# Altium project Convector_digit.PrjPcb
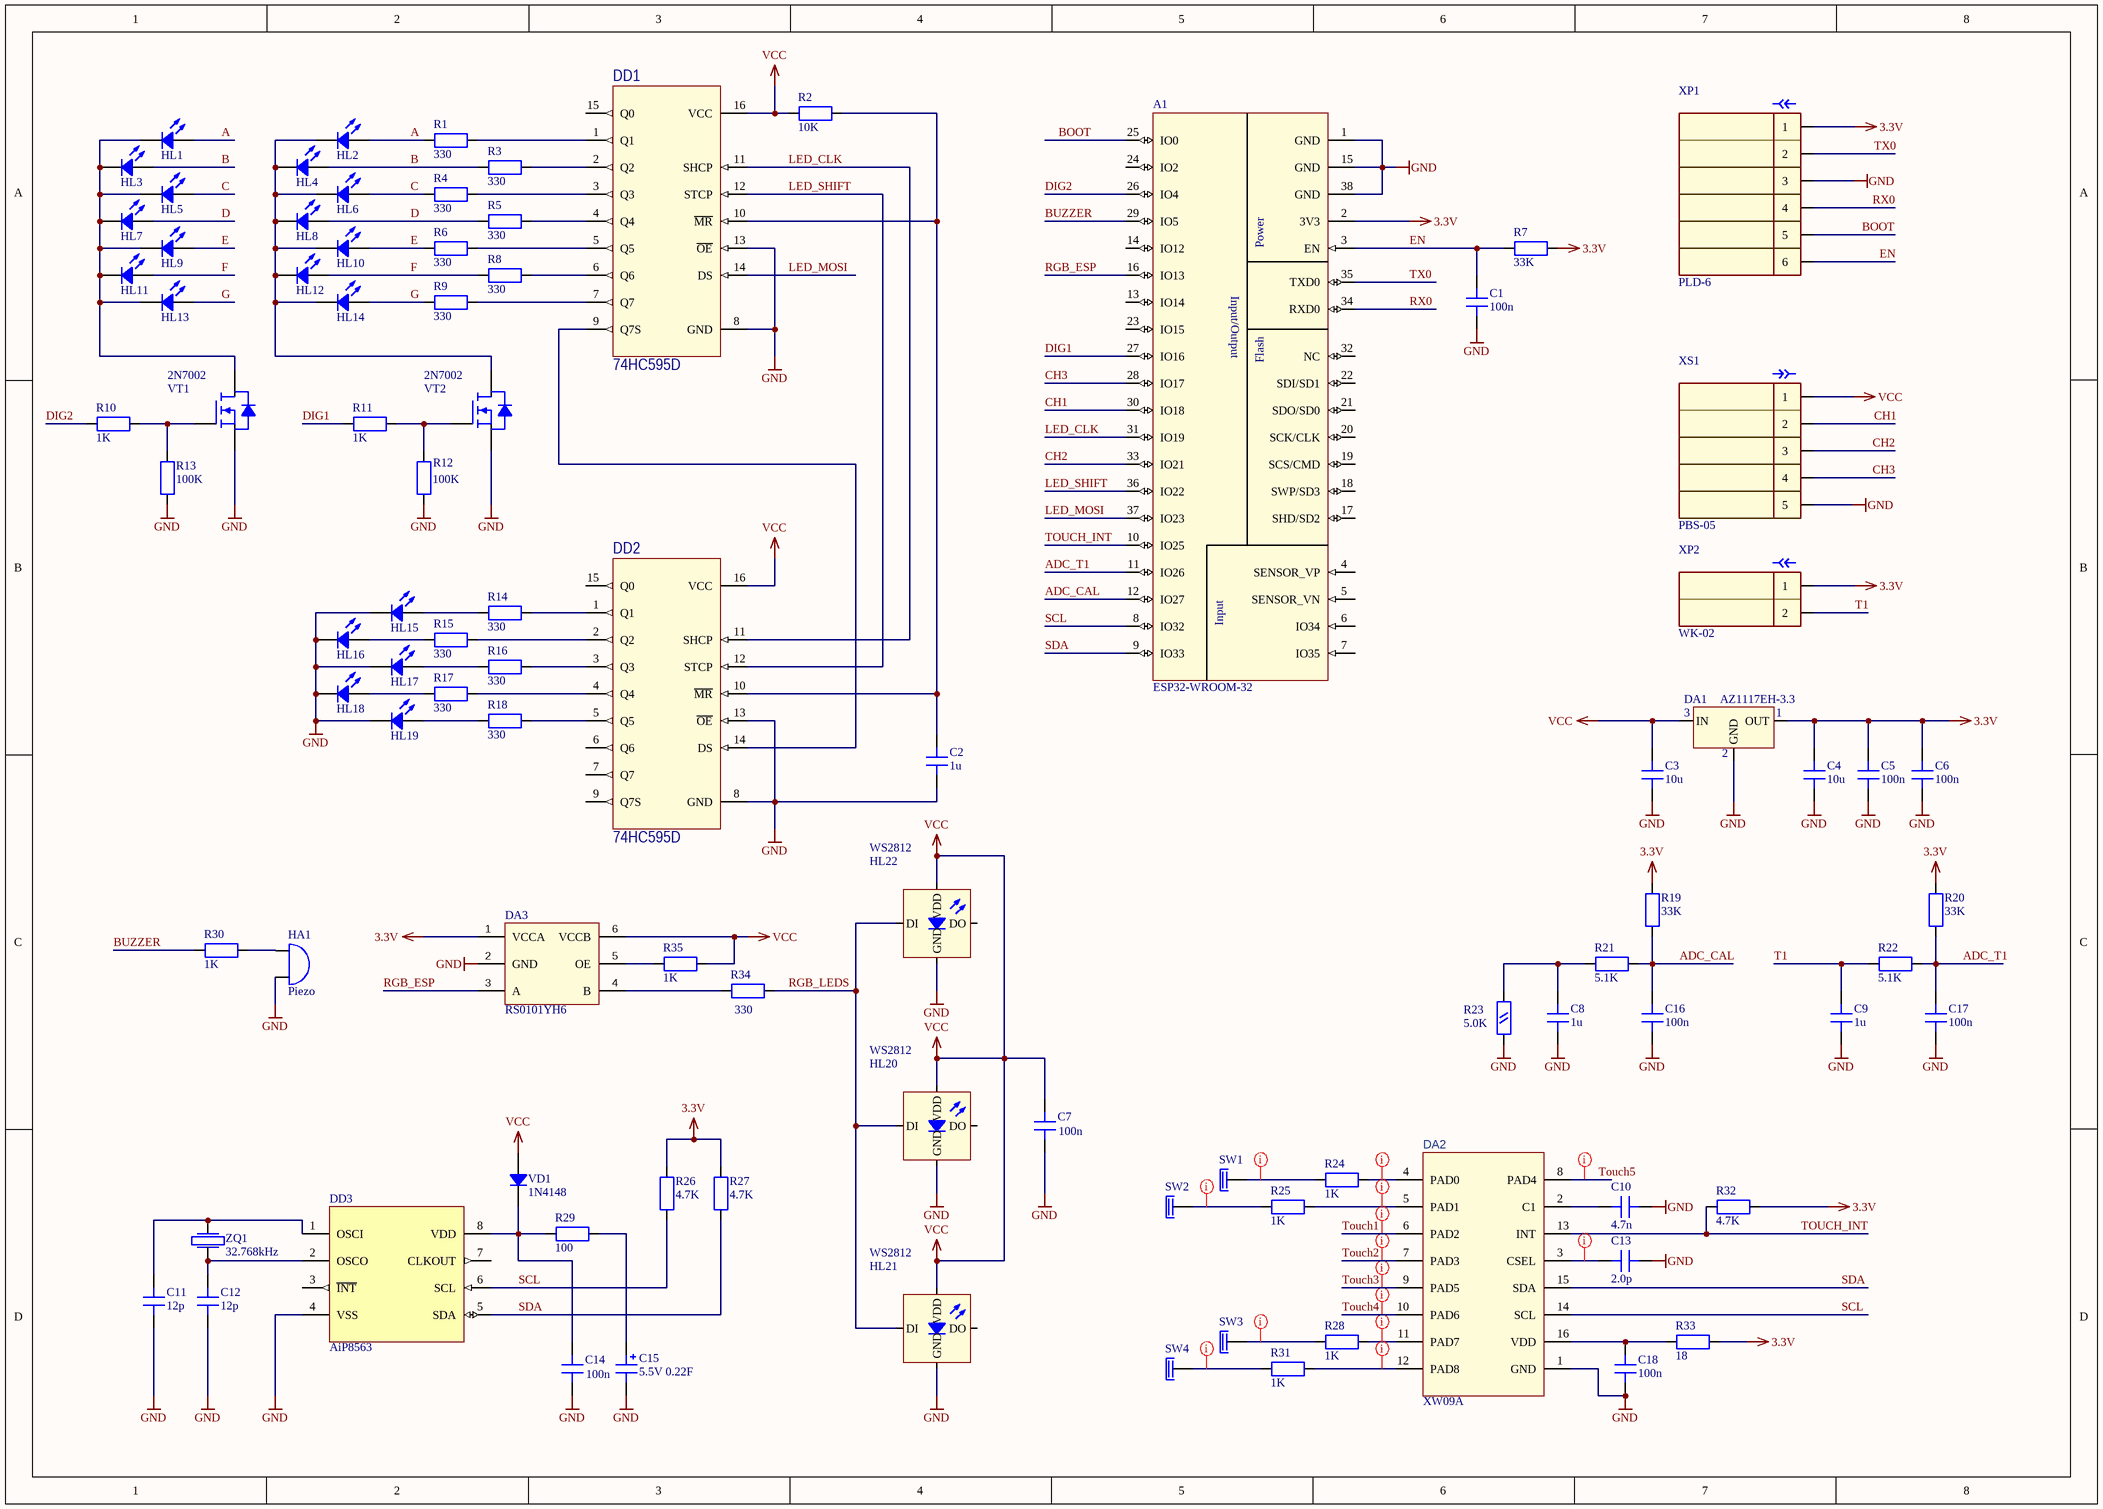
[diagram p0: Convector_digit.SchDoc]
1 sheet, 94 parts. Net scope: global (net labels, ports and power ports of the same name join across sheets).
Board file: Convector_digit.PcbDoc

## Sheet Convector_digit.SchDoc
size A3; SheetNumber: 1; SheetTotal: 1

### Parts
A1  ESP32-WROOM-32  [ESP-WROOM-32]
C1  100n  [C0603]
C2  1u  [C0603]
C3  10u  [C0805]
C4  10u  [C0805]
C5  100n  [C0603]
C6  100n  [C0603]
C7  100n  [C0603]
C8  1u  [C0603]
C9  1u  [C0603]
C10  4.7n  [C0603]
C11  12p  [C0603]
C12  12p  [C0603]
C13  2.0p  [C0603]
C14  100n  [C0603]
C15  5.5V 0.22F  [1207H]
C16  100n  [C0603]
C17  100n  [C0603]
C18  100n  [C0603]
DA1  AZ1117EH-3.3  [SOT-223]
DA2  XW09A  [SO-16]
DA3  RS0101YH6  [SOT-23-6]
DD1  74HC595D  [SO-16]
DD2  74HC595D  [SO-16]
DD3  AiP8563  [SO-8]
HA1  Piezo  [PS1240P02BT]
HL1  0603 White  [LED0603Y]  (value not drawn)
HL2  0603 White  [LED0603Y]  (value not drawn)
HL3  0603 White  [LED0603Y]  (value not drawn)
HL4  0603 White  [LED0603Y]  (value not drawn)
HL5  0603 White  [LED0603Y]  (value not drawn)
HL6  0603 White  [LED0603Y]  (value not drawn)
HL7  0603 White  [LED0603Y]  (value not drawn)
HL8  0603 White  [LED0603Y]  (value not drawn)
HL9  0603 White  [LED0603Y]  (value not drawn)
HL10  0603 White  [LED0603Y]  (value not drawn)
HL11  0603 White  [LED0603Y]  (value not drawn)
HL12  0603 White  [LED0603Y]  (value not drawn)
HL13  0603 White  [LED0603Y]  (value not drawn)
HL14  0603 White  [LED0603Y]  (value not drawn)
HL15  0603 White  [LED0603Y]  (value not drawn)
HL16  0603 White  [LED0603Y]  (value not drawn)
HL17  0603 White  [LED0603Y]  (value not drawn)
HL18  0603 White  [LED0603Y]  (value not drawn)
HL19  0603 White  [LED0603Y]  (value not drawn)
HL20  WS2812  [WS2812C-2020]
HL21  WS2812  [WS2812C-2020]
HL22  WS2812  [WS2812C-2020]
R1  330  [R0603]
R2  10K  [R0603]
R3  330  [R0603]
R4  330  [R0603]
R5  330  [R0603]
R6  330  [R0603]
R7  33K  [R0603]
R8  330  [R0603]
R9  330  [R0603]
R10  1K  [R0603]
R11  1K  [R0603]
R12  100K  [R0603]
R13  100K  [R0603]
R14  330  [R0603]
R15  330  [R0603]
R16  330  [R0603]
R17  330  [R0603]
R18  330  [R0603]
R19  33K  [R0603]
R20  33K  [R0603]
R21  5.1K  [R0603]
R22  5.1K  [R0603]
R23  5.0K  [R0805]
R24  1K  [R0603]
R25  1K  [R0603]
R26  4.7K  [R0603]
R27  4.7K  [R0603]
R28  1K  [R0603]
R29  100  [R0603]
R30  1K  [R0603]
R31  1K  [R0603]
R32  4.7K  [R0603]
R33  18  [R0603]
R34  330  [R0603]
R35  1K  [R0603]
SW1  XL-2258  [XL-2258]  (value not drawn)
SW2  XL-2258  [XL-2258]  (value not drawn)
SW3  XL-2258  [XL-2258]  (value not drawn)
SW4  XL-2258  [XL-2258]  (value not drawn)
VD1  1N4148  [SOD-323_DIODE]
VT1  2N7002  [SOT-23-3]
VT2  2N7002  [SOT-23-3]
XP1  PLD-6  [PLD-6]
XP2  WK-02  [WK-02]
XS1  PBS-05  [PBS-05]
ZQ1  32.768kHz  [KX-327NHT]

### Nets
3.3V: A1.2(3V3) C4.2 C5.2 C6.2 DA1.Y(OUT) DA3.1(VCCA) R7.2 R19.2 R20.2 R26.2 R27.2 R32.2 R33.2 XP1.1 XP2.1
GND: A1.1(GND) A1.15(GND) A1.38(GND) C1.1 C2.1 C3.1 C4.1 C5.1 C6.1 C7.1 C8.1 C9.1 C10.2 C11.1 C12.1 C13.2 C14.2 C15.- C16.1 C17.1 C18.1 DA1.X(GND) DA2.1(GND) DA3.2(GND) DD1.8(GND) DD1.13(~{OE}) DD2.8(GND) DD2.13(~{OE}) DD3.4(VSS) HA1.2 HL15.C HL16.C HL17.C HL18.C HL19.C HL20.-(GND) HL21.-(GND) HL22.-(GND) R12.1 R13.1 R23.1 VT1.Z(S) VT2.Z(S) XP1.3 XS1.5
VCC: C3.2 C7.2 DA1.Z(IN) DA3.6(VCCB) DD1.16(VCC) DD2.16(VCC) HL20.+(VDD) HL21.+(VDD) HL22.+(VDD) R2.1 R35.2 VD1.A XS1.1
A: HL1.A HL2.A R1.1
ADC_CAL: A1.12(IO27) C16.2 R19.1 R21.2
ADC_T1: A1.11(IO26) C17.2 R20.1 R22.2
B: HL3.A HL4.A R3.1
BOOT: A1.25(IO0) XP1.5
BUZZER: A1.29(IO5) R30.2
C: HL5.A HL6.A R4.1
CH1: A1.30(IO18) XS1.2
CH2: A1.33(IO21) XS1.3
CH3: A1.28(IO17) XS1.4
D: HL7.A HL8.A R5.1
DIG1: A1.27(IO16) R11.2
DIG2: A1.26(IO4) R10.2
E: HL9.A HL10.A R6.1
EN: A1.3(EN) C1.2 R7.1 XP1.6
F: HL11.A HL12.A R8.1
G: HL13.A HL14.A R9.1
LED_CLK: A1.31(IO19) DD1.11(SHCP) DD2.11(SHCP)
LED_MOSI: A1.37(IO23) DD1.14(DS)
LED_SHIFT: A1.36(IO22) DD1.12(STCP) DD2.12(STCP)
RGB_ESP: A1.16(IO13) DA3.3(A)
RGB_LEDS: HL20.I(DI) HL21.I(DI) HL22.I(DI) R34.2
RX0: A1.34(RXD0) XP1.4
SCL: A1.8(IO32) DA2.14(SCL) DD3.6(SCL) R26.1
SDA: A1.9(IO33) DA2.15(SDA) DD3.5(SDA) R27.1
T1: C9.2 R22.1 XP2.2
Touch1: DA2.6(PAD2)
Touch2: DA2.7(PAD3)
Touch3: DA2.9(PAD5)
Touch4: DA2.10(PAD6)
Touch5: DA2.8(PAD4)
TOUCH_INT: A1.10(IO25) DA2.13(INT) R32.1
TX0: A1.35(TXD0) XP1.2
NetC2_2: C2.2 DD1.10(~{MR}) DD2.10(~{MR}) R2.2
NetC8_2: C8.2 R21.1 R23.2
NetC10_1: C10.1 DA2.2(C1)
NetC11_2: C11.2 DD3.1(OSCI) ZQ1.1
NetC12_2: C12.2 DD3.2(OSCO) ZQ1.2
NetC13_1: C13.1 DA2.3(CSEL)
NetC14_1: C14.1 DD3.8(VDD) R29.1 VD1.C
NetC15_+: C15.+ R29.2
NetC18_2: C18.2 DA2.16(VDD) R33.1
NetDA2_4: DA2.4(PAD0) R24.2
NetDA2_5: DA2.5(PAD1) R25.2
NetDA2_11: DA2.11(PAD7) R28.2
NetDA2_12: DA2.12(PAD8) R31.2
NetDA3_4: DA3.4(B) R34.1
NetDA3_5: DA3.5(OE) R35.1
NetDD1_1: DD1.1(Q1) R1.2
NetDD1_2: DD1.2(Q2) R3.2
NetDD1_3: DD1.3(Q3) R4.2
NetDD1_4: DD1.4(Q4) R5.2
NetDD1_5: DD1.5(Q5) R6.2
NetDD1_6: DD1.6(Q6) R8.2
NetDD1_7: DD1.7(Q7) R9.2
NetDD1_9: DD1.9(Q7S) DD2.14(DS)
NetDD2_1: DD2.1(Q1) R14.2
NetDD2_2: DD2.2(Q2) R15.2
NetDD2_3: DD2.3(Q3) R16.2
NetDD2_4: DD2.4(Q4) R17.2
NetDD2_5: DD2.5(Q5) R18.2
NetHA1_1: HA1.1 R30.1
NetHL1_C: HL1.C HL3.C HL5.C HL7.C HL9.C HL11.C HL13.C VT1.Y(D)
NetHL2_C: HL2.C HL4.C HL6.C HL8.C HL10.C HL12.C HL14.C VT2.Y(D)
NetHL15_A: HL15.A R14.1
NetHL16_A: HL16.A R15.1
NetHL17_A: HL17.A R16.1
NetHL18_A: HL18.A R17.1
NetHL19_A: HL19.A R18.1
NetR10_1: R10.1 R13.2 VT1.X(G)
NetR11_1: R11.1 R12.2 VT2.X(G)
NetR24_1: R24.1 SW1.1
NetR25_1: R25.1 SW2.1
NetR28_1: R28.1 SW3.1
NetR31_1: R31.1 SW4.1

Not connected (* = marked no-connect by the designer): A1 4(SENSOR_VP) 5(SENSOR_VN) 6(IO34) 7(IO35) 13(IO14) 14(IO12) 17(SHD/SD2) 18(SWP/SD3) 19(SCS/CMD) 20(SCK/CLK) 21(SDO/SD0) 22(SDI/SD1) 23(IO15) 24(IO2) 32(NC); DD1 15(Q0); DD2 6(Q6) 7(Q7) 9(Q7S) 15(Q0); DD3 3(~{INT}) 7(CLKOUT); HL20 O(DO); HL21 O(DO); HL22 O(DO)

### Layout directives
net class touch1: NetR24_1, NetR25_1, NetR28_1, NetR31_1
net class touch: NetC13_1, NetDA2_4, NetDA2_5, NetDA2_11, NetDA2_12, Touch1, Touch2, Touch3, Touch4, Touch5

### Notes on the sheet
- Title
- Size:
- Date:
- A3
- Number:
- Time:
- Revision:
- Sheet
- of
- File:
- (in symbol 1489) 3; 1; 2
- (in symbol 3576) Power; Input/Output; Flash; Input

### Library data of the parts
A1 = 3576: Bluetooth, WiFi 802.11b/g/n, Bluetooth v4.2 +EDR, Class 1, 2 and 3 Transceiver Module 2.4GHz ~ 2.5GHz Integrated, Trace Surface Mount; Manufacturer: Espressif Systems; ID: 3576; LCPN: C82899; Type: Modules; MFPN: ESP32-WROOM-32; Value: ESP32-WROOM-32; Footprint Type: SMD; Supplier: LC; URL: https://lcsc.com/product-detail/WIFI-Modules_Espressif-Systems-ESP32-WROOM-32_C82899.html; Symbol: ESP32-WROOM-32
C1 C5-C7 C14 C16-C18 = 1234: Cap Ceramic, 0603, ±10%, 50V, X7R (X5R), -55 +125C (-55 +85C); ID: 1234; Type: Capacitors; MFPN: 0603B104K500NT; LCPN: C187860; Value: 100n; Footprint Type: SMD; URL: https://lcsc.com/product-detail/Multilayer-Ceramic-Capacitors-MLCC-SMD-SMT_YAGEO-CC0603KRX7R9BB104_C14663.html; Symbol: Capacitor
C2 C8 C9 = 1246: Cap Ceramic, 0603, ±10%, 50V, X7R (X5R), -55 +125C (-55 +85C); ID: 1246; Type: Capacitors; MFPN: CL10A105KO8NNNC; LCPN: C1592; Value: 1u; Footprint Type: SMD; URL: https://lcsc.com/product-detail/Multilayer-Ceramic-Capacitors-MLCC-SMD-SMT_Samsung-Electro-Mechanics-CL10A105KO8NNNC_C1592.html; Symbol: Capacitor
C3 C4 = 1331: Cap Ceramic, 0805, ±10%, 50V, X7R (X5R), -55 +125C (-55 +85C); ID: 1331; Type: Capacitors; LCPN: C17024; Value: 10u; Footprint Type: SMD; Symbol: Capacitor
C10 = 1218: Cap Ceramic, 0603, ±10%, 50V, X7R (X5R), -55 +125C (-55 +85C); ID: 1218; Type: Capacitors; MFPN: 0603B472K500NT; LCPN: C53987; Value: 4.7n; Footprint Type: SMD; Symbol: Capacitor
C11 C12 = 1163: Cap Ceramic, 0603, 5%, 50V, NPO (C0G), -55 +125C; ID: 1163; Type: Capacitors; MFPN: CL10C120JB8NNNC; LCPN: C38523; Value: 12p; Footprint Type: SMD; URL: https://lcsc.com/product-detail/Multilayer-Ceramic-Capacitors-MLCC-SMD-SMT_Samsung-Electro-Mechanics-CL10C120JB8NNNC_C38523.html; Symbol: Capacitor
C13 = 1144: Cap Ceramic, 0603, 5%, 50V, NPO (C0G), -55 +125C; ID: 1144; Type: Capacitors; MFPN: CL10C020CB8NNNC; LCPN: C21895; Value: 2.0p; Footprint Type: SMD; URL: https://lcsc.com/product-detail/Multilayer-Ceramic-Capacitors-MLCC-SMD-SMT_SAMSUNG_CL10C020CB8NNNC_2-0pF-020-0-25pF-50V_C21895.html; Symbol: Capacitor
C15 = 3579: Ionistor 5.5V 0.22F; Manufacturer: WTSCAP (Wenting); ID: 3579; Type: Capacitors; MFPN: WTC5V50F22Z-0510H; LCPN: C389744; Value: 5.5V 0.22F; Footprint Type: TH; Supplier: LC; URL: https://item.szlcsc.com/365848.html; Symbol: Capacitor_polarised
DA1 = 1489: IC, Vreg, LDO, For Low ESR MLCC Cout, SOT223; ID: 1489; MFPN: AZ1117EH-3.3TRG1; LCPN: C108494; Type: Microschemes; Value: AZ1117EH-3.3; Footprint Type: SMD; Supplier: JLC; URL: https://lcsc.com/product-detail/Low-Dropout-Regulators-LDO_DIODES_AZ1117EH-3-3TRG1_AZ1117EH-3-3TRG1_C108494.html; Symbol: LDO_1117
DA2 = 3620: SOP-16 Touch Screen Controller ICs RoHS; Manufacturer: Sam&wing; Group: Микросхемы; ID: 3620; LCPN: C441720; Name: XW09A; Value: XW09A; Supplier: LC; LCSC_PartNumber: C441720; Type: Microschemes; MFPN: XW09A; Footprint Type: SMD; URL: https://lcsc.com/product-detail/Touch-Screen-Controller-ICs_Sam-wing-XW09A_C441720.html; Symbol: XW09X
DA3 = 3597: Level Translators, Shifters RoHS; Manufacturer: Jiangsu RUNIC Tech; ID: 3597; LCPN: C2762287; Type: Microschemes; MFPN: RS0101YH6; Value: RS0101YH6; Footprint Type: SMD; Supplier: LC; URL: https://lcsc.com/product-detail/Level-Translators-Shifters_Jiangsu-RUNIC-Tech-RS0101YH6_C2762287.html; Symbol: RS0101YH6
DD1 DD2 = 3557: Shift Register Serial to parallel, serial SOIC-16_150mil; Manufacturer: Shenzhen Fuman Elec; ID: 3557; MFPN: 74HC595D,118; LCPN: C2798023; Type: Microschemes; Value: 74HC595D; Footprint Type: SMD; Supplier: LC; URL: https://lcsc.com/product-detail/74-Series_Nexperia-74HC595D-118_C5947.html; Symbol: 74HC595D
DD3 = 3578: SOP-8 Real-time Clocks RoHS; Manufacturer: Wuxi I-core Elec; ID: 3578; LCPN: C116087; Type: Microschemes; MFPN: AiP8563; Value: AiP8563; Footprint Type: SMD; Symbol: AiP8563; Supplier: LC
HA1 = 1501: BUZZER, Piezo, Pitch 5mm (TDK); ID: 1501; LCPN: C219727; Type: Audio; MFPN: PS1240P02BT; Value: Piezo; Footprint Type: TH; Supplier: LC; Symbol: Buzzer
HL1-HL19 = 3558: LED, SMD 0603, 30mA, White; Manufacturer: Orient; ID: 3558; MFPN: ORH-W46G; LCPN: C205448; Type: LED; Value: 0603 White; Footprint Type: SMD; Supplier: LC; URL: https://lcsc.com/product-detail/Light-Emitting-Diodes-LED_Orient-ORH-W46G_C205448.html; Symbol: LED
HL20-HL22 = 3562: Intelligent control LED, 2.0x2.0mm; Manufacturer: Worldsemi; ID: 3562; Value: WS2812C-2020; LCPN: C965556; Type: LED; MFPN: WS2812C-2020; Footprint Type: SMD; Supplier: LC; URL: https://lcsc.com/product-detail/Light-Emitting-Diodes-LED_Worldsemi-WS2812C-2020_C965556.html; Symbol: WS2812C-2020
R1 R3-R6 R8 R9 R14-R18 R34 = 61: Res, 0603, 1%, 1/10W; Manufacturer: Walsin Tech Corp; ID: 61; MFPN: WR06X3300FTL; LCPN: C163905; Type: Resistors; Value: 330; Footprint Type: SMD; Supplier: JLC; URL: https://lcsc.com/product-detail/Chip-Resistor-Surface-Mount_Walsin-Tech-Corp-WR06X3300FTL_C163905.html; Symbol: Resistor
R2 = 97: Res, 0603, 1%, 1/10W; Manufacturer: FH(Guangdong Fenghua Advanced Tech); ID: 97; MFPN: RS-03K1002FT; LCPN: C115324; Type: Resistors; Value: 10K; Footprint Type: SMD; Supplier: JLC; URL: https://lcsc.com/product-detail/Chip-Resistor-Surface-Mount_FH-Guangdong-Fenghua-Advanced-Tech-RS-03K1002FT_C115324.html; Symbol: Resistor
R7 R19 R20 = 109: Res, 0603, 1%, 1/10W; Manufacturer: UNI-ROYAL(Uniroyal Elec); ID: 109; MFPN: 0603WAF3302T5E; LCPN: C4216; Type: Resistors; Value: 33K; Footprint Type: SMD; Supplier: JLC; URL: https://lcsc.com/product-detail/Chip-Resistor-Surface-Mount_UNI-ROYAL-Uniroyal-Elec-0603WAF3302T5E_C4216.html; Symbol: Resistor
R10 R11 R24 R25 R28 R30 R31 R35 = 73: Res, 0603, 1%, 1/10W; Manufacturer: FH(Guangdong Fenghua Advanced Tech); ID: 73; MFPN: RS-03K1002FT; LCPN: C115325; Type: Resistors; Value: 1K; Footprint Type: SMD; Supplier: JLC; URL: https://lcsc.com/product-detail/Chip-Resistor-Surface-Mount_FH-Guangdong-Fenghua-Advanced-Tech-RS-03K1001FT_C115325.html; Symbol: Resistor
R12 R13 = 121: Res, 0603, 1%, 1/10W; Manufacturer: UNI-ROYAL(Uniroyal Elec); ID: 121; MFPN: 0603WAF1003T5E; LCPN: C25803; Type: Resistors; Value: 100K; Footprint Type: SMD; Supplier: JLC; URL: https://lcsc.com/product-detail/Chip-Resistor-Surface-Mount_UNI-ROYAL-Uniroyal-Elec-0603WAF1003T5E_C25803.html; Symbol: Resistor
R21 R22 = 90: Res, 0603, 1%, 1/10W; ID: 90; MFPN: RS-03K5101FT; LCPN: C156350; Type: Resistors; Value: 5.1K; Footprint Type: SMD; Symbol: Resistor
R23 = 3606: Res, 0805, 0.1%, 1/8W; ID: 3606; LCPN: C78980; Type: Resistors; Value: 5.0K; Footprint Type: SMD; Supplier: LC; Symbol: Resistor_1/8W
R26 R27 R32 = 89: Res, 0603, 1%, 1/10W; Manufacturer: UNI-ROYAL(Uniroyal Elec); ID: 89; MFPN: 0603WAF4701T5E; LCPN: C23162; Type: Resistors; Value: 4.7K; Footprint Type: SMD; Supplier: JLC; URL: https://lcsc.com/product-detail/Chip-Resistor-Surface-Mount_UNI-ROYAL-Uniroyal-Elec-0603WAF4701T5E_C23162.html; Symbol: Resistor
R29 = 49: Res, 0603, 1%, 1/10W; Manufacturer: UNI-ROYAL(Uniroyal Elec); ID: 49; MFPN: 0603WAF1000T5E; LCPN: C22775; Type: Resistors; Value: 100; Footprint Type: SMD; Supplier: JLC; URL: https://lcsc.com/product-detail/Chip-Resistor-Surface-Mount_UNI-ROYAL-Uniroyal-Elec-0603WAF1000T5E_C22775.html; Symbol: Resistor
R33 = 31: Res, 0603, 1%, 1/10W; ID: 31; Type: Resistors; Value: 18; Footprint Type: SMD; Symbol: Resistor
SW1-SW4 = 1502: Sensor Spring D=5.5/8.5, H=8.5±0.5mm; ID: 1502; Type: Switches; MFPN: XL-2258; Value: XL-2258; Footprint Type: TH; Supplier: TB - BIG; Symbol: SENSOR_SPRING
VD1 = 1464: Small Signal Fast Switching Diode, 150mA, 75V; ID: 1464; Type: Diodes; MFPN: 1N4148WS; Value: 1N4148WS; LCPN: C108805; Footprint Type: SMD; Supplier: JLC; URL: https://lcsc.com/product-detail/Switching-Diode_Shandong-Jingdao-Microelectronics-1N4148WS_C108805.html; Symbol: Diode
VT1 VT2 = 1470: HEXFET Power MOSFET N-CH; ID: 1470; Type: Transistors; MFPN: GM7002E; LCPN: C8545; Value: 2N7002; Footprint Type: SMD; Supplier: JLC; Symbol: N-MOS
XP1 = 3581: 2x3 Male pld pins 2.54; ID: 3581; Type: Connectors; Value: PLD-6; Footprint Type: TH; Symbol: MALE_6PIN
XP2 = 1448: Through-hole type shrouded header, XH Series, 2.5mm; ID: 1448; MFPN: B2B-XH-A(LF)(SN); Value: B2B-XH-A (LF) (SN) (WK-02); LCPN: C158012; Type: Connectors; Footprint Type: TH; Supplier: JLC; URL: https://lcsc.com/product-detail/Wire-To-Board-Wire-To-Wire-Connector_JST-Sales-America_B2B-XH-A-LF-SN_JST-Sales-America-B2B-XH-A-LF-SN_C158012.html; Symbol: MALE_2PIN
XS1 = 1506: Through-hole type shrouded header, XH Series, 2.5mm; ID: 1506; MFPN: 2.54 单排排母5PIN，直插，塑高8.5mm; LCPN: C50950; Type: Connectors; Value: PBS-05; Footprint Type: TH; Supplier: JLC; Symbol: FEMALE_5PIN
ZQ1 = 1504: Quartz 32.768kHz 12.5pF 20ppm; ID: 1504; MFPN: FC-135 32.768000kHz 12.5 +20.0-20.0; LCPN: C164062; Type: Quartzes; Value: 32.768kHz; Footprint Type: SMD; Supplier: JLC; URL: https://lcsc.com/product-detail/SMD-Crystal-Resonators_TAE-Zhejiang-Abel-Elec-SMD-3215-2P32-768KHZ12-5PF10PPM_C164062.html; Symbol: QUARTZ